# Altium schematic sheet MPU6050.SchDoc
size A4; Author: Wojciech Grędel; CompanyName: AGH Racing; Revision: 3; SheetNumber: 1; SheetTotal: 1; CarNumber: 6; ProjectName: Project Name
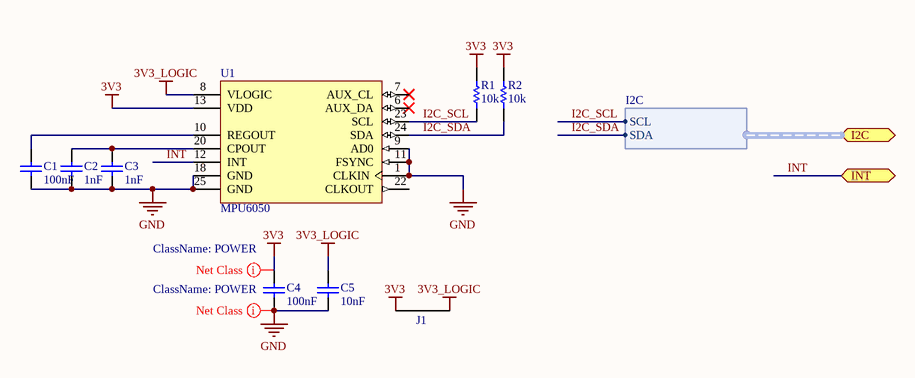
[diagram p0: MPU6050.SchDoc]

## Parts
C1  value 100nF  [CAP_0603_IPC_MD]  (hidden comment: Cap)
C2  value 1nF  [CAP_0603_IPC_MD]  (hidden comment: Cap)
C3  value 1nF  [CAP_0603_IPC_MD]  (hidden comment: Cap)
C4  value 100nF  [CAP_0603_IPC_MD]  (hidden comment: Cap)
C5  value 10nF  [CAP_0603_IPC_MD]  (hidden comment: Cap)
J1  NetTie  [NETTIE]  (value not drawn)  (net tie, no BOM)
R1  value 10k  [RES_0603_IPC_HD]  (hidden comment: Res)
R2  value 10k  [RES_0603_IPC_HD]  (hidden comment: Res)
U1  MPU6050  [QFN24_IPC_MD]

## Ports
I2C (harness I2C), INT (bidir)

## Harnesses
I2C: SCL, SDA

## Nets
3V3: C4.2 J1.1 R1.2 R2.2 U1.13(VDD)
3V3_LOGIC: C5.2 J1.2 U1.8(VLOGIC)
GND: C1.1 C2.1 C3.1 C4.1 C5.1 U1.1(CLKIN) U1.9(AD0) U1.11(FSYNC) U1.18(GND) U1.25(GND)
I2C_SCL: R1.1 U1.23(SCL) ; port I2C.SCL
I2C_SDA: R2.1 U1.24(SDA) ; port I2C.SDA
INT: U1.12(INT) ; port INT
NetC1_2: C1.2 U1.10(REGOUT)
NetC2_2: C2.2 C3.2 U1.20(CPOUT)

Not connected (* = marked no-connect by the designer): U1 6(AUX_DA)* 7(AUX_CL)* 19(RESV) 21(RESV) 22(CLKOUT)

## Layout directives
net class POWER: 3V3, GND

## Notes on the sheet
- Confidential / Not for distribution !
- Document name:
- Designer Name:
- Date/Time:
- Revision:

## Library data of the parts
C1-C5 = Cap: Capacitor
R1 R2 = Res: Resistor
U1 = MPU6050: 3 axis accelerometer and gyroscope; Manufacturer: Invensense; Part Number: MPU6050; Supplier: Farnell; Supplier Part Number: 1864742; Type: IC; Mounting Technology: SMD; Manufacturer Part Number: MPU-6050
J1 = NetTie: Part Number: NetTie